# EAGLE design 1605_lora_ES920B (EAGLE 9.5.1)
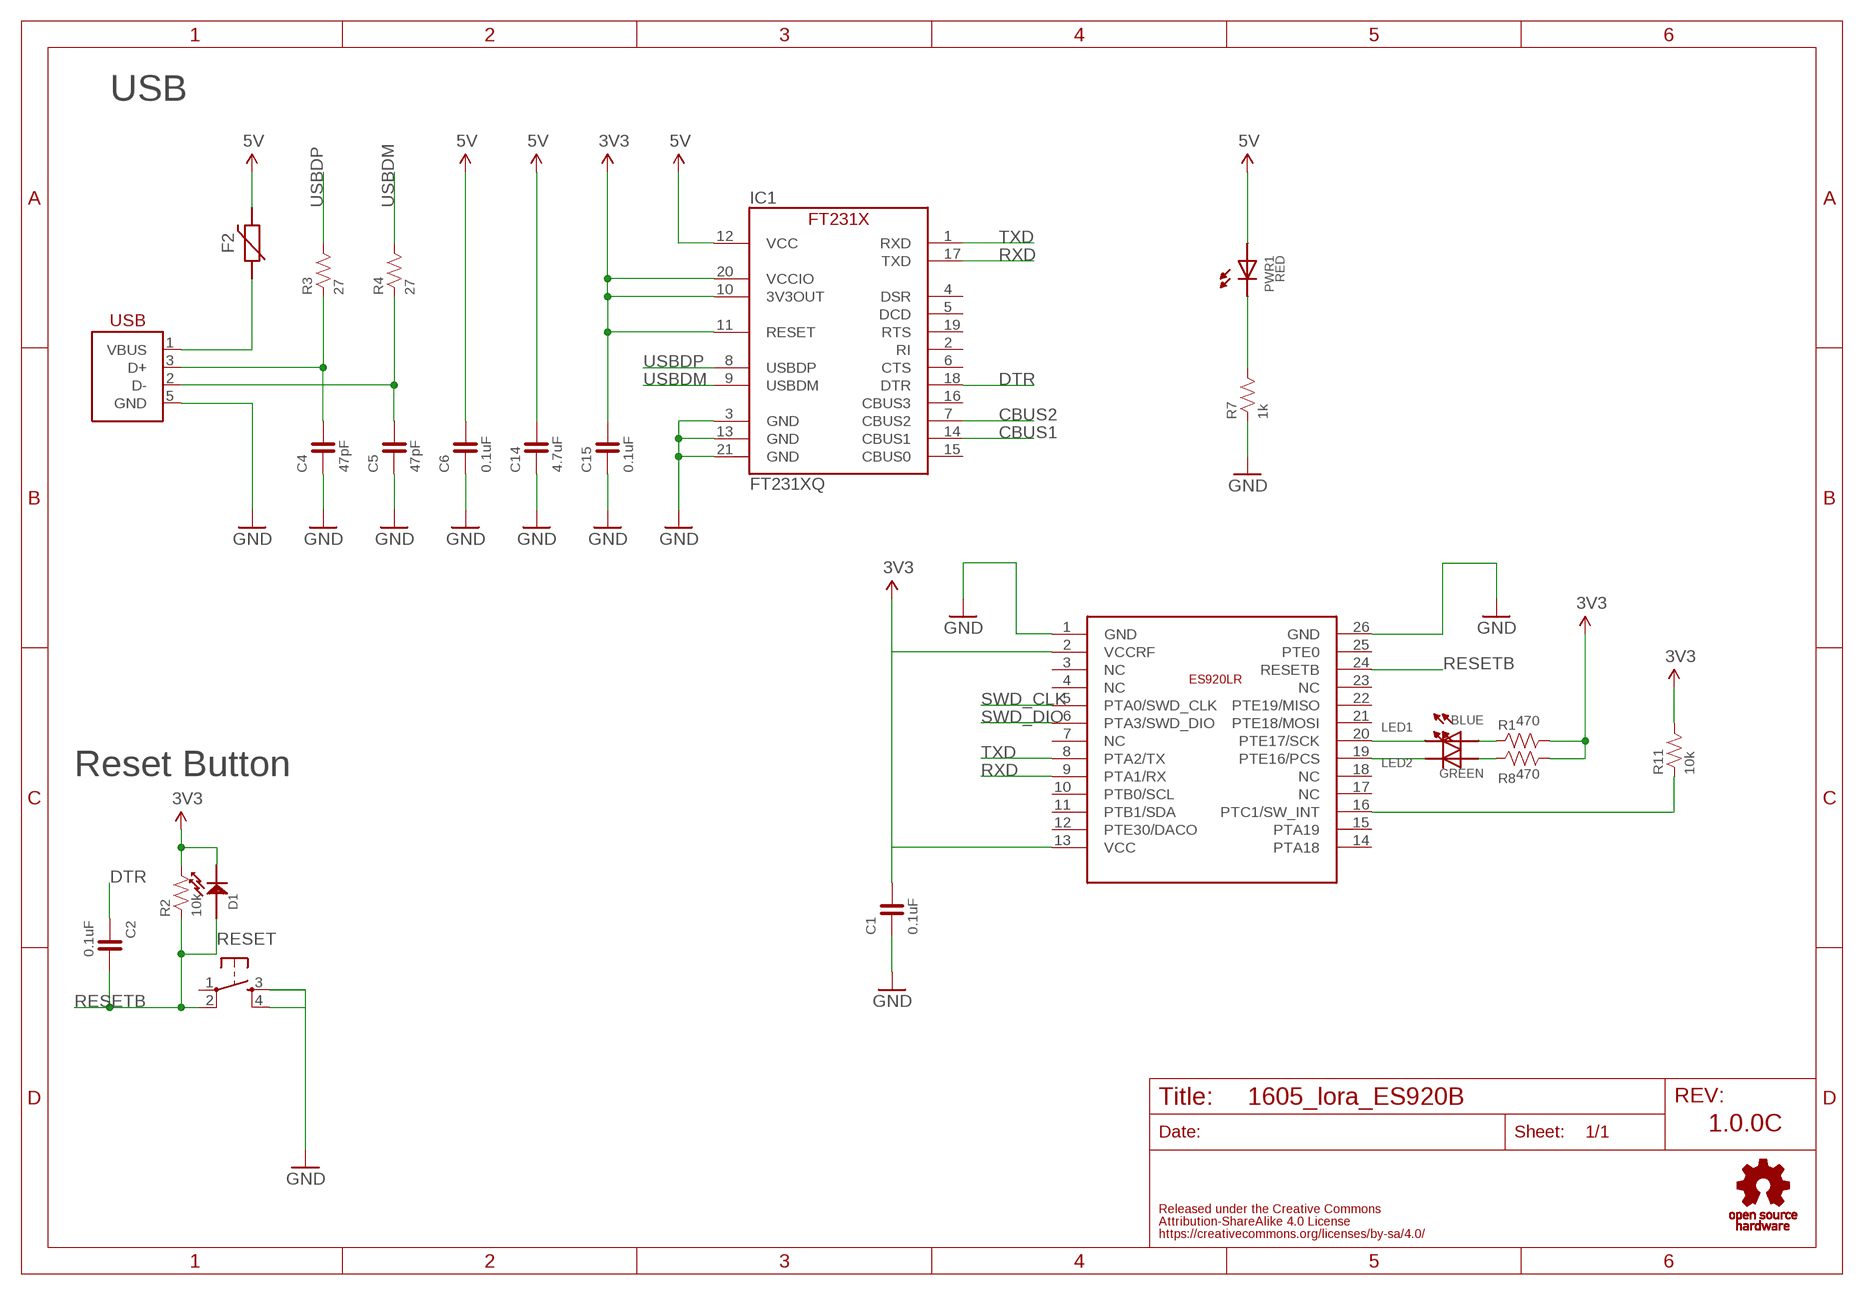
[diagram p0: schematic, sheet 1]

## Parts
C1  0.1uF  CAPACITOR-0603_NARROW  [0603-NARROW]
C2  0.1uF  CAPACITOR-0603_NARROW  [0603-NARROW]
C4  47pF  CAPACITOR-0603_NARROW  [0603-NARROW]
C5  47pF  CAPACITOR-0603_NARROW  [0603-NARROW]
C6  0.1uF  CAPACITOR-0603_NARROW  [0603-NARROW]
C14  4.7uF  CAPACITOR-0603_NARROW  [0603-NARROW]
C15  0.1uF  CAPACITOR-0603_NARROW  [0603-NARROW]
D1  DIODE0603  [0603]
F2  POLYSWITCH  [NANOSMDC035F]
IC1  FT231XQ  [QFN-20_FT231X]
LED1  BLUE  LED-0603  [0603]
LED2  GREEN  LED-0603  [0603]
PWR1  RED  LED-0603-NARROW  [0603-NARROW]
R1  470  RESISTOR-0603-NARROW  [0603-NARROW]
R2  10k  RESISTOR-0603-NARROW  [0603-NARROW]
R3  27  RESISTOR-0603-NARROW  [0603-NARROW]
R4  27  RESISTOR-0603-NARROW  [0603-NARROW]
R7  1k  RESISTOR-0603-NARROW  [0603-NARROW]
R8  470  RESISTOR-0603-NARROW  [0603-NARROW]
R11  10k  RESISTOR-0603-NARROW  [0603-NARROW]
RESET  TACT-SWITCH-SMD_KMR2  [KMR2]
U2  ES920LR_MODULE  [MODULE]
U$2  LOGO_OSHW-M_BOTTOM  [LOGO_OSHW_M_BOTTOM]
USB1  USB-MICRO_B_SMT_HIROSE  [ZX62R-B-5P]

## Nets
3V3: C1.2 C15.2 D1.CATHODE IC1.10(3V3OUT) IC1.11(RESET) IC1.20(VCCIO) R1.2 R2.2 R8.2 R11.2 U2.2(VCCRF) U2.13(VCC)
5V: C6.2 C14.2 F2.2 IC1.12(VCC) PWR1.ANODE
CBUS1: IC1.14(CBUS1)
CBUS2: IC1.7(CBUS2)
DTR: C2.1 IC1.18(DTR)
GND: C1.1 C4.1 C5.1 C6.1 C14.1 C15.1 IC1.3(GND) IC1.13(GND) IC1.21(GND) R7.1 U2.1(GND) USB1.5(GND)
N$1: RESET.3 RESET.4 ; supply symbol labelled GND
N$2: U2.26(GND) ; supply symbol labelled GND
N$3: LED2.CATHODE U2.19(PTE16/PCS)
N$4: LED1.CATHODE U2.20(PTE17/SCK)
N$5: LED1.ANODE R1.1
N$6: LED2.ANODE R8.1
N$7: C5.2 R4.1 USB1.2(D-)
N$8: C4.2 R3.1 USB1.3(D+)
N$11: PWR1.CATHODE R7.2
N$12: R11.1 U2.16(PTC1/SW_INT)
RESETB: C2.2 D1.ANODE R2.1 RESET.2 U2.24(RESETB)
RXD: IC1.17(TXD) U2.9(PTA1/RX)
SWD_CLK: U2.5(PTA0/SWD_CLK)
SWD_DIO: U2.6(PTA3/SWD_DIO)
TXD: IC1.1(RXD) U2.8(PTA2/TX)
USBDM: IC1.9(USBDM) R4.2
USBDP: IC1.8(USBDP) R3.2
VBUS1: F2.1 USB1.1(VBUS)
Unconnected: IC1.2(RI) IC1.4(DSR) IC1.5(DCD) IC1.6(CTS) IC1.15(CBUS0) IC1.16(CBUS3) IC1.19(RTS) RESET.1 U2.3(NC) U2.4(NC) U2.7(NC) U2.10(PTB0/SCL) U2.11(PTB1/SDA) U2.12(PTE30/DACO) U2.14(PTA18) U2.15(PTA19) U2.17(NC) U2.18(NC) U2.21(PTE18/MOSI) U2.22(PTE19/MISO) U2.23(NC) U2.25(PTE0)

## Notes on the sheet
- USB
- Reset Button
- 1.0.0C

## Library data of the parts
C1 C2 C4-C6 C14 C15 = FaBo-Capacitor:CAPACITOR: CAPACITOR
D1 = FaBo-Diode:DIODE
F2 = FaBo-Parts:POLYSWITCH
IC1 = FaBo-USB:FT231X
LED1 LED2 PWR1 = FaBo-LED:LED
R1-R4 R7 R8 R11 = FaBo-Resistors:RESISTOR: RESISTOR
RESET = FaBo-Switch:TACT-SWITCH: Part No Maker Datasheet Distributor 1273HA-160G-G SWITRONIC Catalog <http://www.switronic.com/uploads/images/A10.gif> Akizuki <http://akizukidenshi.com/catalog/g/gP-02561/> DTS-6-V Cosland DTS 6 Series <http://www.cosland.com/newproduct/DTS%20SERIES.pdf> Akizuki <http://akizukidenshi.com/catalog/g/gP-03647/> KMR2 C&K KMR2 SERIES <https://www.ckswitches.com/products/switches/product-details/Tactile/KMR2/> Octoparts Result <https://octopart.com/search?q=KMR2&start=0> TSHA-T-XB2-19E TOP UP INDUSTORY TSHA-T <http://www.top-up.com.tw/front/bin/ptdetail.phtml?Part=TSHA-T> Akizuki <http://akizukidenshi.com/catalog/g/gP-09361/>
U2 = FaBo-LoRa:ES920LR_MODULE
U$2 = FaBo-Logo:LOGO_OSHW
USB1 = FaBo-USB:USB

## Board
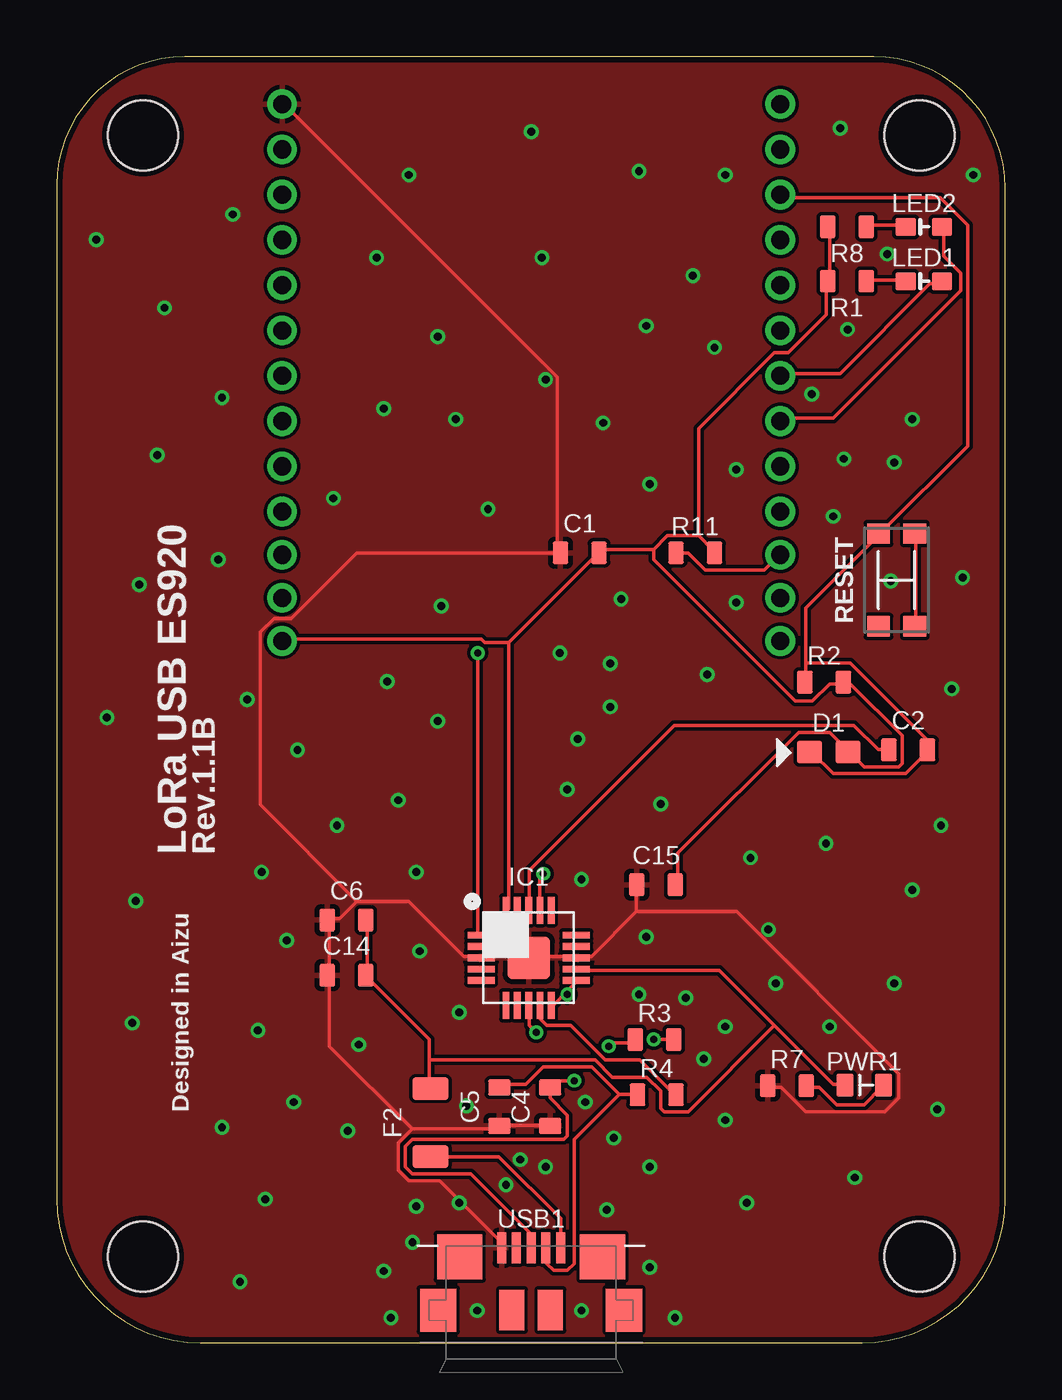
[diagram p1: board, top side]
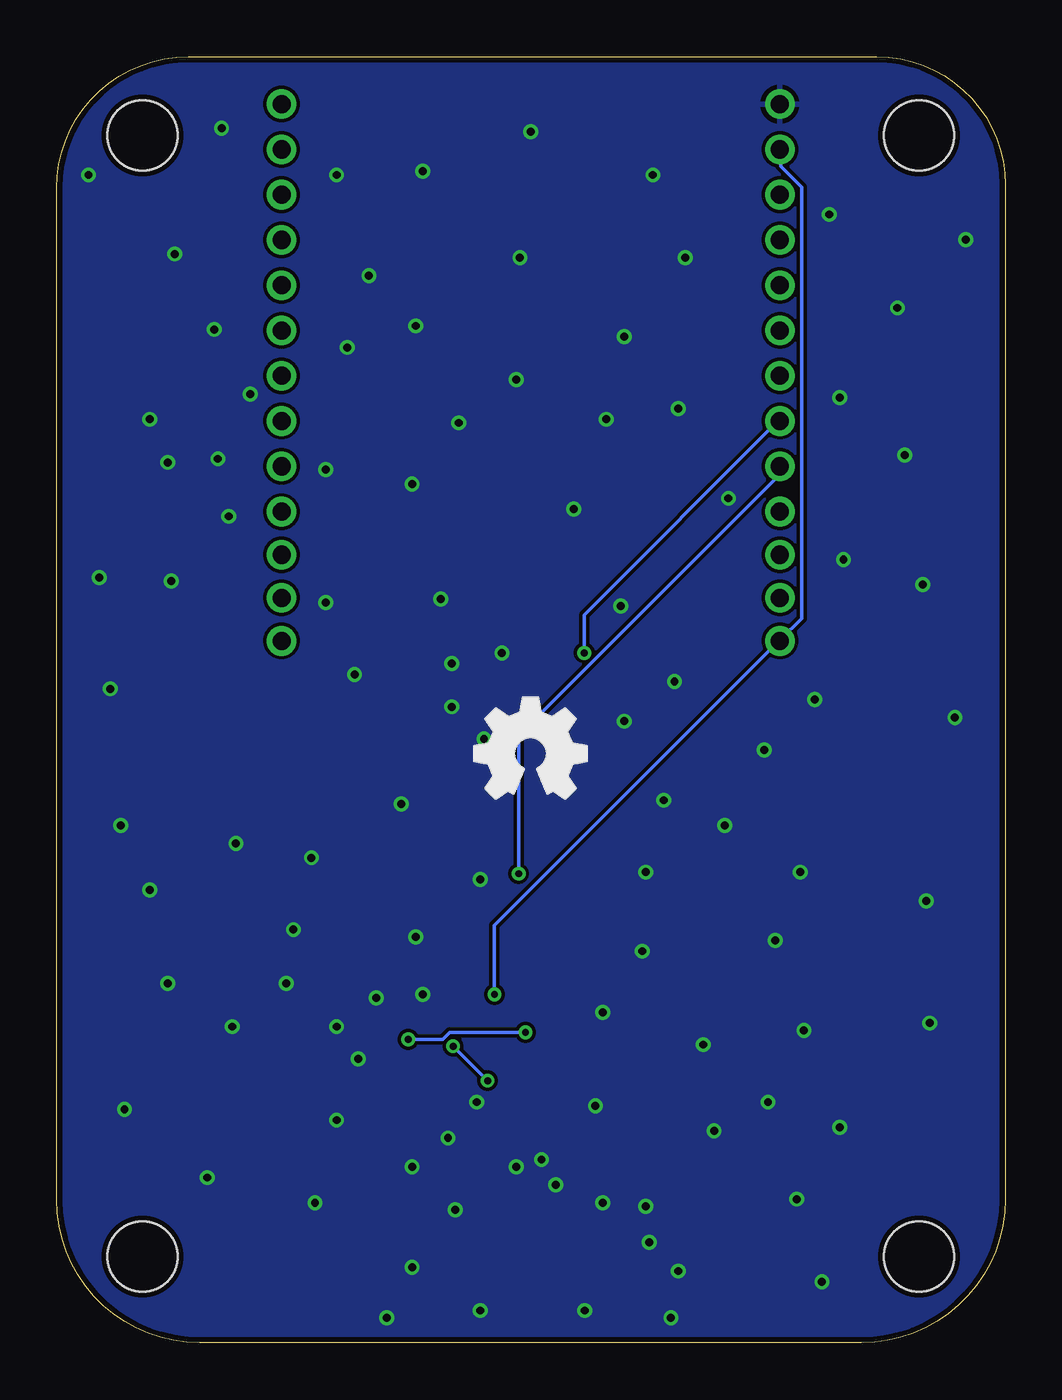
[diagram p2: board, bottom side, seen from below]

Size 41.89 x 56.82 mm. Coordinates in mm from the lower left corner, seen from the top.
Outline: 0,51.16 0,6.35 arc90 6.35,0 35.57,0 arc90 41.89,6.32 41.89,51.01 arc90 36.08,56.82 5.67,56.82 arc90 0,51.16
Copper layers (1*16): Top 0.035mm / dielectric 1.6mm / Bottom 0.035mm
Design rules "PCBway": minimum track width 6mil, minimum drill 12mil, track to track 6mil, track to pad 6mil, pad to pad 6mil, via to via 6mil, smd to smd 6mil, copper to edge 10mil, drill to drill 10mil, minimum pad ring 10mil, minimum via ring 6mil, stop-mask expansion 2mil, vias tented up to drill 100mil, thermal gap 8mil
Holes 3.1 mm at 3.81,53.34 38.1,53.34 38.1,3.81 3.81,3.81

### Footprints (pad centres in the part's own frame; a part is rotated, then mirrored left to right if it is on the bottom)
0603-NARROW = smd 0.71 x 1: 1 -0.85,0; 2 0.85,0
0603 = smd 1.1 x 1: ANODE -0.85,0; CATHODE 0.85,0
NANOSMDC035F = smd 1 x 1.6: 1 -1.5,0; 2 1.5,0
QFN-20_FT231X = smd 1.2 x 0.3: 1 -2.1,1; 2 -2.1,0.5; 3 -2.1,0; 4 -2.1,-0.5; 5 -2.1,-1; 11 2.1,-1; 12 2.1,-0.5; 13 2.1,0; 14 2.1,0.5; 15 2.1,1 | smd 0.3 x 1.2: 6 -1,-2.1; 7 -0.5,-2.1; 8 0,-2.1; 9 0.5,-2.1; 10 1,-2.1; 16 1,2.1; 17 0.5,2.1; 18 0,2.1; 19 -0.5,2.1; 20 -1,2.1 | smd 1.9 x 1.9: 21 0,0
0603' = smd 0.9 x 0.8: ANODE -0.8,0; CATHODE 0.8,0
0603-NARROW' = smd 0.75 x 1: ANODE -0.85,0; CATHODE 0.85,0
KMR2 = smd 0.9 x 1: 1 -2.05,0.8; 2 2.05,0.8; 3 2.05,-0.8; 4 -2.05,-0.8
MODULE = drill 0.8 pad 1.27: 1 -11,9; 2 -11,7; 3 -11,5; 4 -11,3; 5 -11,1; 6 -11,-1; 7 -11,-3; 8 -11,-5; 9 -11,-7; 10 -11,-9; 11 -11,-10.905; 12 -11,-12.81; 13 -11,-14.715; 14 11,-14.715; 15 11,-12.81; 16 11,-10.905; 17 11,-9; 18 11,-7; 19 11,-5; 20 11,-3; 21 11,-1; 22 11,1; 23 11,3; 24 11,5; 25 11,7; 26 11,9
ZX62R-B-5P = smd 0.4 x 1.35: 1 1.3,4.2; 2 0.65,4.2; 3 0,4.2; 4 -0.65,4.2; 5 -1.3,4.2 | smd 2 x 2: 6 3.15,3.8; 7 -3.15,3.8 | smd 1.6 x 1.9: 8 4.1,1.45; 11 -4.1,1.45 | smd 1.1 x 1.8: 9 0.85,1.45; 10 -0.85,1.45

### Placement (x,y rotation side)
C1  23.1,34.9 0 top
C2  37.6,26.2 0 top
C4  21.79,10.43 90 top
C5  19.55,10.43 90 top
C6  12.8,18.68 0 top
C14  12.8,16.24 0 top
C15  26.47,20.24 0 top
D1  34.1,26.1 0 top
F2  16.51,9.73 90 top
IC1  20.84,17.01 0 top
LED1  BLUE  [0603']  38.3,46.9 0 top
LED2  GREEN  [0603']  38.3,49.3 0 top
PWR1  RED  [0603-NARROW']  35.66,11.39 0 top
R1  34.9,46.9 180 top
R2  33.89,29.19 0 top
R3  26.4,13.4 0 top
R4  26.5,10.96 0 top
R7  32.25,11.36 0 top
R8  34.9,49.3 180 top
R11  28.2,34.9 0 top
RESET  37.09,33.7 90 top
U2  20.95,45.72 0 top
U$2  20.95,26.04 0 top
USB1  20.95,0 0 top

### Tracks (layer width: path | path; a pad name or v marks a point on that pad's centre or on a via)
3V3  (via drill 0.3)
  Top 0.152: C15.2 27.43,20.27 27.43,21.64 32.77,26.98 34.14,26.98 34.9,26.21 D1.CATHODE 35.05,26.06 35.66,25.45 37.19,25.45 37.34,25.6 37.34,26.82 35.05,29.11 34.75,29.11 R2.2 34.59,29.11 34.14,29.11 33.38,28.35 32.61,28.35 26.36,34.59 26.36,35.05 | R8.2 34.14,49.23 34.14,46.94 R1.2 33.98,46.79 33.98,45.41 32.31,43.74 31.7,43.74 28.35,40.39 28.35,35.66 | 26.36,35.05 24.08,35.05 C1.2 23.93,34.9 19.96,30.94 | 26.36,35.05 26.98,35.66 28.35,35.66 | 28.35,35.66 28.96,35.05 R11.2 | 19.96,30.94 19.96,19.2 IC1.20 | 22.55,15.54 23.01,16 IC1.11 | 22.55,15.54 21.95,14.94 IC1.10 | v22.55,15.39 22.55,15.54 | 19.96,30.94 18.9,30.94 18.75,31.09 10.06,31.09 U2.13
  Bottom 0.152: v22.55,15.39 22.55,18.44 10.06,30.94 U2.13 9.91,31.09 8.99,32 8.99,51.05 9.91,51.97 9.91,52.58 U2.2
5V
  Top 0.152: C6.2 13.72,18.59 13.72,16.31 C14.2 13.72,16.15 16.46,13.41 16.46,12.5 | 16.46,12.5 16.46,11.28 F2.2 | 31.7,14.02 29.26,16.46 23.01,16.46 IC1.12 | 31.7,14.02 34.29,11.43 34.75,11.43 PWR1.ANODE | 16.46,12.5 23.77,12.5 24.54,11.73 26.06,11.73 26.67,11.12 26.67,10.36 26.82,10.21 27.89,10.21 31.7,14.02
DTR
  Top 0.152: C2.1 36.73,26.21 36.27,26.21 35.2,27.28 27.28,27.28 20.88,20.88 20.88,19.2 IC1.18
GND  (via drill 0.35)
  Top 0.152: U2.1 10.06,54.71 22.1,42.67 22.1,35.05 C1.1 22.1,34.9 13.26,34.9 10.36,32 9.6,32 8.99,31.39 8.99,23.77 13.26,19.51 | C4.1 21.64,9.6 19.66,9.6 C5.1 19.51,9.45 15.7,9.45 | 15.7,9.45 15.09,8.84 15.09,7.62 15.54,7.16 16.92,7.16 19.51,4.57 19.51,4.27 USB1.5 | 15.7,9.45 12.04,13.11 12.04,16.15 C14.1 12.04,16.31 12.04,18.59 C6.1 12.04,18.75 12.5,18.75 13.26,19.51 | 25.6,19.05 25.6,20.12 C15.1 | 25.6,19.05 23.62,17.07 23.01,17.07 IC1.13 22.86,17.07 20.88,17.07 IC1.21 20.73,17.07 18.75,17.07 IC1.3 18.59,17.07 17.98,17.07 15.54,19.51 13.26,19.51 | 25.6,19.05 30.02,19.05 37.19,11.89 37.19,10.82 36.58,10.21 33.07,10.21 32,11.28 31.55,11.28 R7.1
  other vias: 24.45,30 16.99,32.54 16.83,27.46 24.45,28.1 26.67,23.81 27.78,15.24 31.43,18.26 21.59,7.78 15.88,6.03 30.48,6.19 26.19,7.78 17.78,14.61 13.34,13.18 15.88,20.8 12.22,37.31 17.62,40.8 14.45,41.27 4.76,45.72 4.45,39.21 3.65,33.5 2.22,27.62 3.49,19.53 3.33,14.13 37.78,40.8 34.77,39.05 30,38.58 30,32.7 34.29,36.51 33.34,41.91 34.92,44.77 37.78,20 39.53,28.89 33.97,22.07 36.99,15.88 38.89,10.32 15.56,51.59 25.72,51.75 28.1,47.15 24.13,40.64 21.43,47.94 16.83,44.45 1.75,48.74 34.61,53.66 40.48,51.59 19.05,36.83 20.48,8.1 18.1,10.48 19.84,6.99 17.78,6.19 23.18,1.43 18.57,1.43 26.19,3.33 27.3,1.11 24.29,5.87 14.76,1.11 14.45,3.17 15.72,4.45 16.03,17.3 25.72,15.4 26.04,17.94 23.18,20.48 10.64,26.19 12.38,22.86 9.05,20.8 8.89,13.81 9.21,6.35 35.24,7.3 40.01,33.81 36.83,33.66 36.99,38.89 36.67,48.1 29.53,51.59 29.05,43.97 7.78,49.85 7.3,41.75 7.14,34.61 14.61,29.21 8.41,28.42 15.08,23.97 28.73,29.53 24.92,32.86 26.19,37.94 7.3,9.53 12.86,9.37 8.1,2.7 23.34,10.64 24.61,9.05 29.53,9.84 29.53,13.97 28.57,12.54 31.75,15.88 34.13,13.97 22.54,24.45 23.02,26.67 10.16,17.78 10.48,10.64 20.95,53.5 14.13,47.94 21.59,42.55 26.04,44.93 22.23,30.48 39.05,22.86 30.64,21.43
  pour Top: 0,0 41.91,0 41.91,56.83 0,56.83
  pour Bottom: 0,0 41.91,0 41.91,57.15 0,57.15
N$1
  Top 0.152: RESET.4 37.95,31.7 37.95,35.66 RESET.3
N$3
  Top 0.152: LED2.CATHODE 39.17,49.23 39.17,48.01 39.93,47.24 39.93,46.48 34.29,40.84 32,40.84 U2.19
N$4
  Top 0.152: LED1.CATHODE 39.01,46.79 38.56,46.79 34.59,42.82 32,42.82 U2.20
N$5
  Top 0.152: LED1.ANODE 37.49,46.94 35.81,46.94 R1.1
N$6
  Top 0.152: LED2.ANODE 37.49,49.38 35.81,49.38 R8.1
N$7
  Top 0.152: 24.84,10.97 23.62,12.19 21.49,12.19 20.73,11.43 19.66,11.43 C5.2 | 24.84,10.97 25.6,10.97 R4.1 | 24.84,10.97 22.86,8.99 22.86,3.5 22.55,3.2 21.95,3.2 21.64,3.5 21.64,4.12 USB1.2
N$8  (via drill 0.3)
  Top 0.152: USB1.3 20.88,4.27 20.88,4.88 18.29,7.47 15.7,7.47 15.39,7.77 15.39,8.69 15.7,8.99 22.4,8.99 22.55,9.14 22.55,10.06 21.79,10.82 C4.2 21.79,11.43 21.95,11.58 v22.86,11.58 | v24.38,13.11 24.54,13.26 25.45,13.26 R3.1
  Bottom 0.152: v22.86,11.58 v24.38,13.11
N$11
  Top 0.152: R7.2 33.22,11.28 33.68,11.28 34.44,10.52 35.66,10.52 36.42,11.28 PWR1.CATHODE
N$12
  Top 0.152: R11.1 27.43,34.9 27.89,34.9 28.65,34.14 31.24,34.14 31.85,34.75 U2.16
RESETB
  Top 0.152: D1.ANODE 33.38,26.06 34.29,25.15 37.49,25.15 38.41,26.06 C2.2 38.41,26.21 38.41,26.67 35.05,30.02 33.07,30.02 | 33.07,30.02 33.07,32.46 36.27,35.66 RESET.2 36.42,35.81 40.23,39.62 40.23,49.38 39.01,50.6 32,50.6 U2.24 | 33.07,30.02 33.07,29.26 R2.1
RXD  (via drill 0.3)
  Top 0.152: v21.49,20.73 21.34,20.57 21.34,19.2 IC1.17
  Bottom 0.152: v21.49,20.73 21.49,26.82 10.06,38.25 10.06,38.71 U2.9
TXD  (via drill 0.3)
  Top 0.152: v18.59,30.48 18.59,18.14 IC1.1
  Bottom 0.152: v18.59,30.48 18.59,32.16 10.06,40.69 U2.8
USBDM
  Top 0.152: R4.2 27.28,10.97 25.76,12.5 24.23,12.5 22.71,14.02 21.64,14.02 21.34,14.33 21.34,14.78 IC1.9
USBDP  (via drill 0.3)
  Top 0.152: v26.36,13.41 27.13,13.41 R3.2 | v21.18,13.72 20.88,14.02 20.88,14.78 IC1.8
  Bottom 0.152: v26.36,13.41 24.84,13.41 24.54,13.72 v21.18,13.72
VBUS1
  Top 0.152: USB1.1 22.25,4.27 22.25,5.51 19.53,8.23 16.61,8.23 F2.1

### Text on the board
tPlace: LoRa USB ES920 | Rev.1.1B | Designed in Aizu